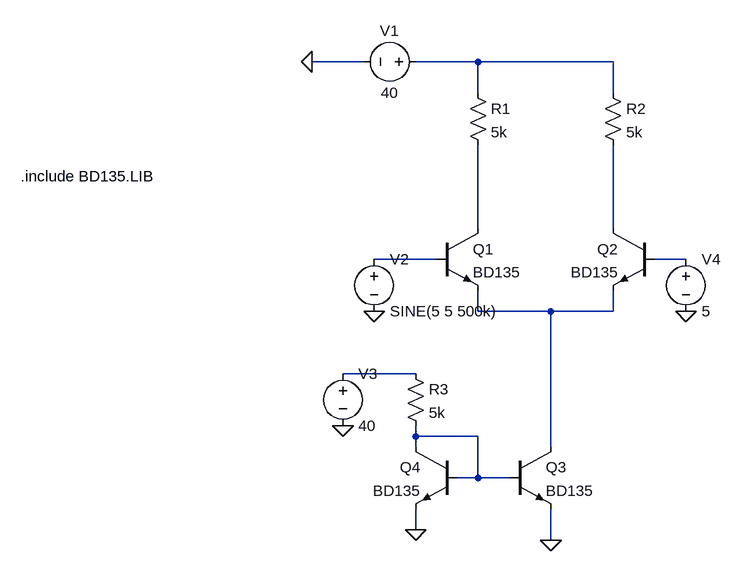
[diagram p0: schematic comparador.asc]
comparador.asc, the LTspice schematic file:
Version 4
SHEET 1 1496 680
WIRE -48 -128 -128 -128
WIRE 128 -128 32 -128
WIRE 336 -128 128 -128
WIRE 128 -80 128 -128
WIRE 336 -80 336 -128
WIRE 128 128 128 0
WIRE 336 128 336 0
WIRE 64 176 -32 176
WIRE 448 176 400 176
WIRE 128 256 128 224
WIRE 240 256 128 256
WIRE 336 256 336 224
WIRE 336 256 240 256
WIRE 32 352 -80 352
WIRE 32 448 32 432
WIRE 128 448 32 448
WIRE 32 464 32 448
WIRE 240 464 240 256
WIRE 128 512 128 448
WIRE 128 512 96 512
WIRE 176 512 128 512
WIRE 32 592 32 560
WIRE 240 608 240 560
FLAG -128 -128 0
FLAG -32 256 0
FLAG 240 608 0
FLAG -80 432 0
FLAG 32 592 0
FLAG 448 256 0
SYMBOL npn 64 128 R0
SYMATTR InstName Q1
SYMATTR Value BD135
SYMBOL npn 400 128 M0
SYMATTR InstName Q2
SYMATTR Value BD135
SYMBOL res 112 -96 R0
SYMATTR InstName R1
SYMATTR Value 5k
SYMBOL res 320 -96 R0
SYMATTR InstName R2
SYMATTR Value 5k
SYMBOL voltage 48 -128 R90
WINDOW 0 -32 56 VBottom 2
WINDOW 3 32 56 VTop 2
SYMATTR InstName V1
SYMATTR Value 40
SYMBOL voltage -32 160 R0
WINDOW 123 0 0 Left 2
WINDOW 39 0 0 Left 2
SYMATTR InstName V2
SYMATTR Value SINE(5 5 500k)
SYMBOL npn 176 464 R0
SYMATTR InstName Q3
SYMATTR Value BD135
SYMBOL npn 96 464 M0
SYMATTR InstName Q4
SYMATTR Value BD135
SYMBOL res 16 336 R0
SYMATTR InstName R3
SYMATTR Value 5k
SYMBOL voltage -80 336 R0
SYMATTR InstName V3
SYMATTR Value 40
SYMBOL voltage 448 160 R0
SYMATTR InstName V4
SYMATTR Value 5
TEXT -576 48 Left 2 !.include BD135.LIB

The netlist it stands for:
* comparador.asc
Q1 N002 N004 N006 0 BD135
Q2 N003 N005 N006 0 BD135
R1 N001 N002 5k
R2 N001 N003 5k
V1 N001 0 40
V2 N004 0 SINE(5 5 500k)
Q3 N006 N008 0 0 BD135
Q4 N008 N008 0 0 BD135
R3 N007 N008 5k
V3 N007 0 40
V4 N005 0 5
.model NPN NPN
.model PNP PNP
.lib standard.bjt
.include BD135.LIB
.backanno
.end